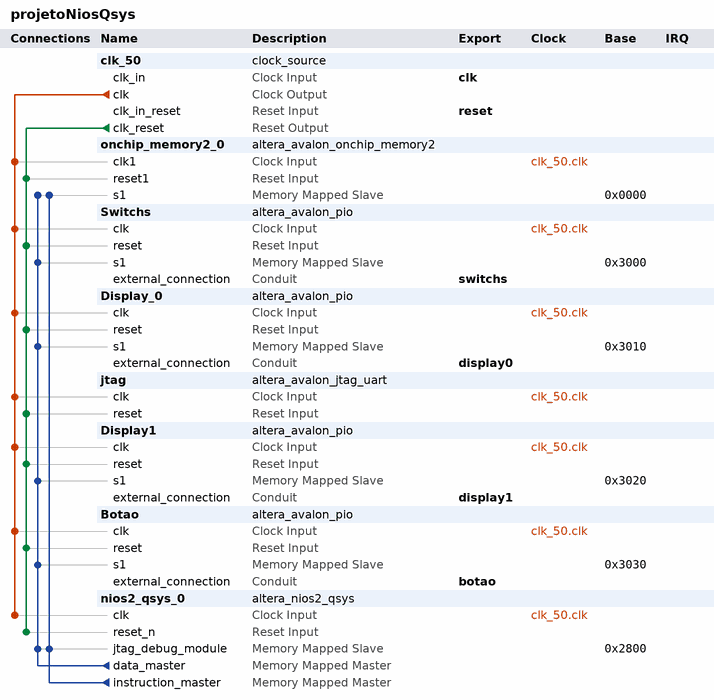
[diagram p0: system contents]
# Platform Designer (Qsys) system projetoNiosQsys, Cyclone IV E EP4CE30F23C7
# Parameters at their usual value, and those the tool derives, are not listed.
package require -exact qsys 16.1
create_system projetoNiosQsys
set_project_property DEVICE_FAMILY {Cyclone IV E}
set_project_property DEVICE EP4CE30F23C7

add_instance clk_50 clock_source 16.1
set_instance_parameter_value clk_50 clockFrequency 50000000

add_instance onchip_memory2_0 altera_avalon_onchip_memory2 16.1
set_instance_parameter_value onchip_memory2_0 dataWidth 32
set_instance_parameter_value onchip_memory2_0 dualPort false
set_instance_parameter_value onchip_memory2_0 initMemContent true
set_instance_parameter_value onchip_memory2_0 initializationFileName C:/intelFPGA_lite/16.1/ProjetoNios/projetoNiosQsys_onchip_memory2_0.hex
set_instance_parameter_value onchip_memory2_0 memorySize 7360
set_instance_parameter_value onchip_memory2_0 useNonDefaultInitFile true

add_instance Switchs altera_avalon_pio 16.1
set_instance_parameter_value Switchs direction Input
set_instance_parameter_value Switchs width 8

add_instance Display_0 altera_avalon_pio 16.1
set_instance_parameter_value Display_0 direction Output
set_instance_parameter_value Display_0 width 8

add_instance jtag altera_avalon_jtag_uart 16.1
set_instance_parameter_value jtag simInteractiveOptions NO_INTERACTIVE_WINDOWS

add_instance Display1 altera_avalon_pio 16.1
set_instance_parameter_value Display1 direction Output
set_instance_parameter_value Display1 width 8

add_instance Botao altera_avalon_pio 16.1
set_instance_parameter_value Botao direction Input
set_instance_parameter_value Botao width 1

add_instance nios2_qsys_0 altera_nios2_qsys 16.1
set_instance_parameter_value nios2_qsys_0 breakSlave nios2_qsys_0.jtag_debug_module
set_instance_parameter_value nios2_qsys_0 exceptionSlave onchip_memory2_0.s1
set_instance_parameter_value nios2_qsys_0 icache_size 4096
set_instance_parameter_value nios2_qsys_0 impl Small
set_instance_parameter_value nios2_qsys_0 mmu_TLBMissExcSlave None
set_instance_parameter_value nios2_qsys_0 muldiv_divider true
set_instance_parameter_value nios2_qsys_0 muldiv_multiplierType LogicElementsFast
set_instance_parameter_value nios2_qsys_0 resetSlave onchip_memory2_0.s1
set_instance_parameter_value nios2_qsys_0 resetrequest_enabled true

# connections
add_connection clk_50.clk Botao.clk clock
add_connection clk_50.clk Display1.clk clock
add_connection clk_50.clk Display_0.clk clock
add_connection clk_50.clk jtag.clk clock
add_connection clk_50.clk nios2_qsys_0.clk clock
add_connection clk_50.clk onchip_memory2_0.clk1 clock
add_connection clk_50.clk Switchs.clk clock
add_connection clk_50.clk_reset Botao.reset reset
add_connection clk_50.clk_reset Display1.reset reset
add_connection clk_50.clk_reset Display_0.reset reset
add_connection clk_50.clk_reset jtag.reset reset
add_connection clk_50.clk_reset nios2_qsys_0.reset_n reset
add_connection clk_50.clk_reset onchip_memory2_0.reset1 reset
add_connection clk_50.clk_reset Switchs.reset reset
add_connection nios2_qsys_0.data_master Botao.s1 avalon
set_connection_parameter_value nios2_qsys_0.data_master/Botao.s1 baseAddress 0x3030
add_connection nios2_qsys_0.data_master Display1.s1 avalon
set_connection_parameter_value nios2_qsys_0.data_master/Display1.s1 baseAddress 0x3020
add_connection nios2_qsys_0.data_master Display_0.s1 avalon
set_connection_parameter_value nios2_qsys_0.data_master/Display_0.s1 baseAddress 0x3010
add_connection nios2_qsys_0.data_master nios2_qsys_0.jtag_debug_module avalon
set_connection_parameter_value nios2_qsys_0.data_master/nios2_qsys_0.jtag_debug_module baseAddress 0x2800
add_connection nios2_qsys_0.data_master onchip_memory2_0.s1 avalon
set_connection_parameter_value nios2_qsys_0.data_master/onchip_memory2_0.s1 baseAddress 0x0000
add_connection nios2_qsys_0.data_master Switchs.s1 avalon
set_connection_parameter_value nios2_qsys_0.data_master/Switchs.s1 baseAddress 0x3000
add_connection nios2_qsys_0.instruction_master nios2_qsys_0.jtag_debug_module avalon
set_connection_parameter_value nios2_qsys_0.instruction_master/nios2_qsys_0.jtag_debug_module baseAddress 0x2800
add_connection nios2_qsys_0.instruction_master onchip_memory2_0.s1 avalon
set_connection_parameter_value nios2_qsys_0.instruction_master/onchip_memory2_0.s1 baseAddress 0x0000

# exported interfaces
add_interface botao conduit end
set_interface_property botao EXPORT_OF Botao.external_connection
add_interface clk clock sink
set_interface_property clk EXPORT_OF clk_50.clk_in
add_interface display0 conduit end
set_interface_property display0 EXPORT_OF Display_0.external_connection
add_interface display1 conduit end
set_interface_property display1 EXPORT_OF Display1.external_connection
add_interface reset reset sink
set_interface_property reset EXPORT_OF clk_50.clk_in_reset
add_interface switchs conduit end
set_interface_property switchs EXPORT_OF Switchs.external_connection

set_interconnect_requirement {$system} qsys_mm.clockCrossingAdapter HANDSHAKE
set_interconnect_requirement {$system} qsys_mm.enableEccProtection FALSE
set_interconnect_requirement {$system} qsys_mm.insertDefaultSlave FALSE
set_interconnect_requirement {$system} qsys_mm.maxAdditionalLatency 1

save_system projetoNiosQsys.qsys
